# Altium schematic sheet SH1 - HIGH LEVEL DESIGN.SchDoc: Jetson AGX Xavier Carrier Board - High Level Design
size B; Engineer: Cindy Li, Chealsie Bains; Organization: UW Robotics; Address1: 200 University Avenue; Address2: Waterloo; Address3: Ontario; Address4: Canada N2L 3G6; DocumentNumber: 1; Revision: 1; SheetNumber: 1; SheetTotal: 12
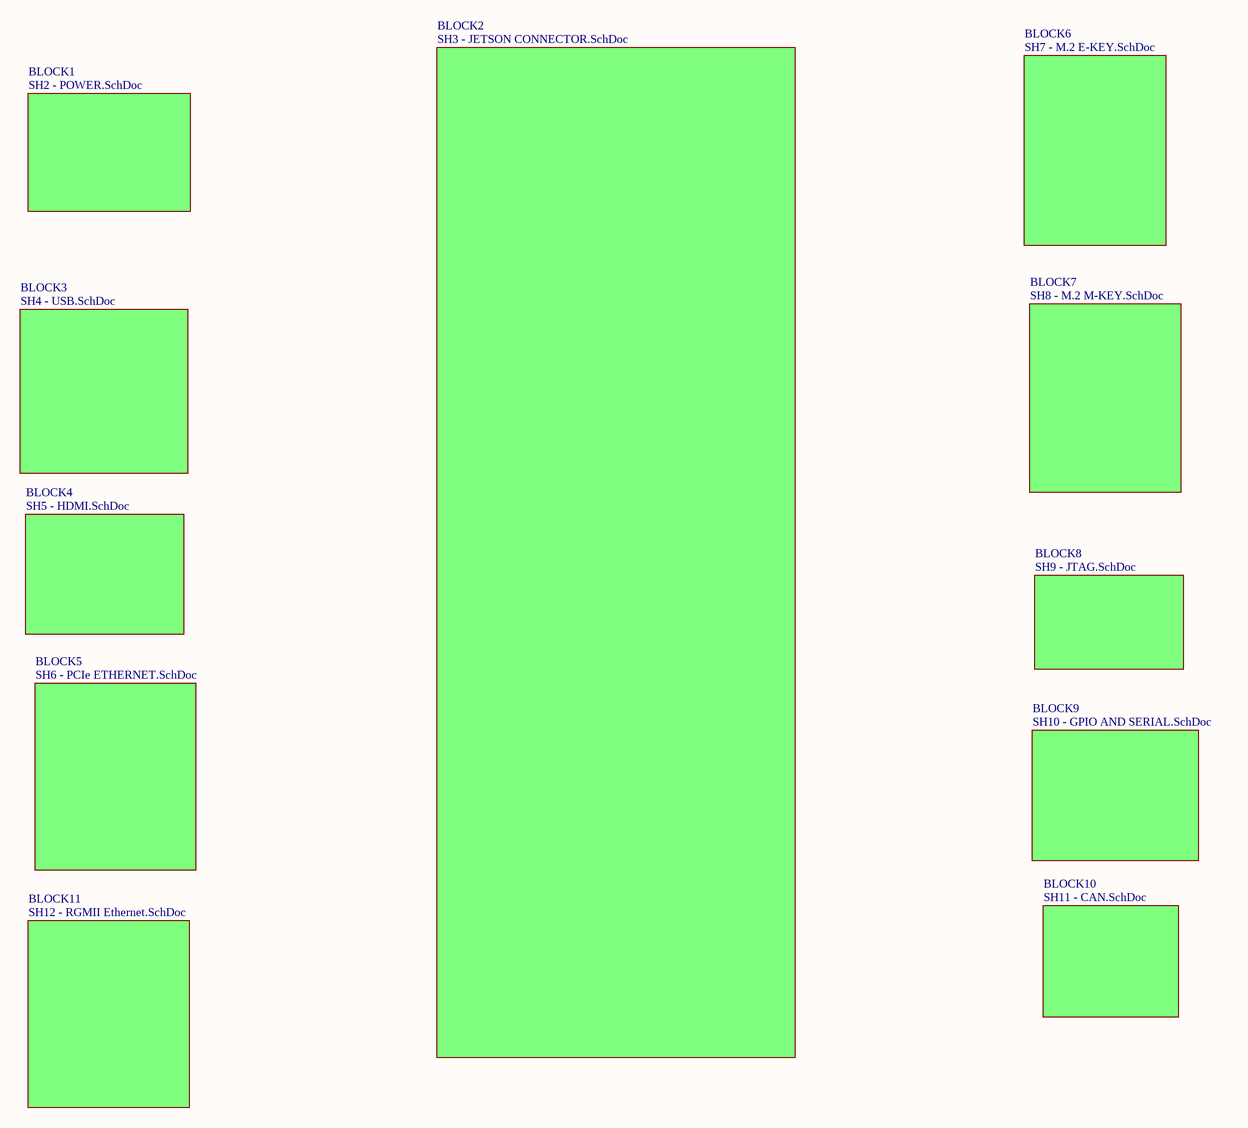
[diagram p0: SH1 - HIGH LEVEL DESIGN.SchDoc]

## Sub-sheets
BLOCK1 = SH2 - POWER.SchDoc: no entries
BLOCK2 = SH3 - JETSON CONNECTOR.SchDoc: no entries
BLOCK3 = SH4 - USB.SchDoc: no entries
BLOCK4 = SH5 - HDMI.SchDoc: no entries
BLOCK5 = SH6 - PCIe ETHERNET.SchDoc: no entries
BLOCK6 = SH7 - M.2 E-KEY.SchDoc: no entries
BLOCK7 = SH8 - M.2 M-KEY.SchDoc: no entries
BLOCK8 = SH9 - JTAG.SchDoc: no entries
BLOCK9 = SH10 - GPIO AND SERIAL.SchDoc: no entries
BLOCK10 = SH11 - CAN.SchDoc: no entries
BLOCK11 = SH12 - RGMII Ethernet.SchDoc: no entries

## Notes on the sheet
- Title:
- Project:
- Date:
- Rev:
- Reviewer:
- Engineer:
- Sheet:
- of